# EAGLE schematic attniy85_prog_shield (EAGLE 8.5.0)
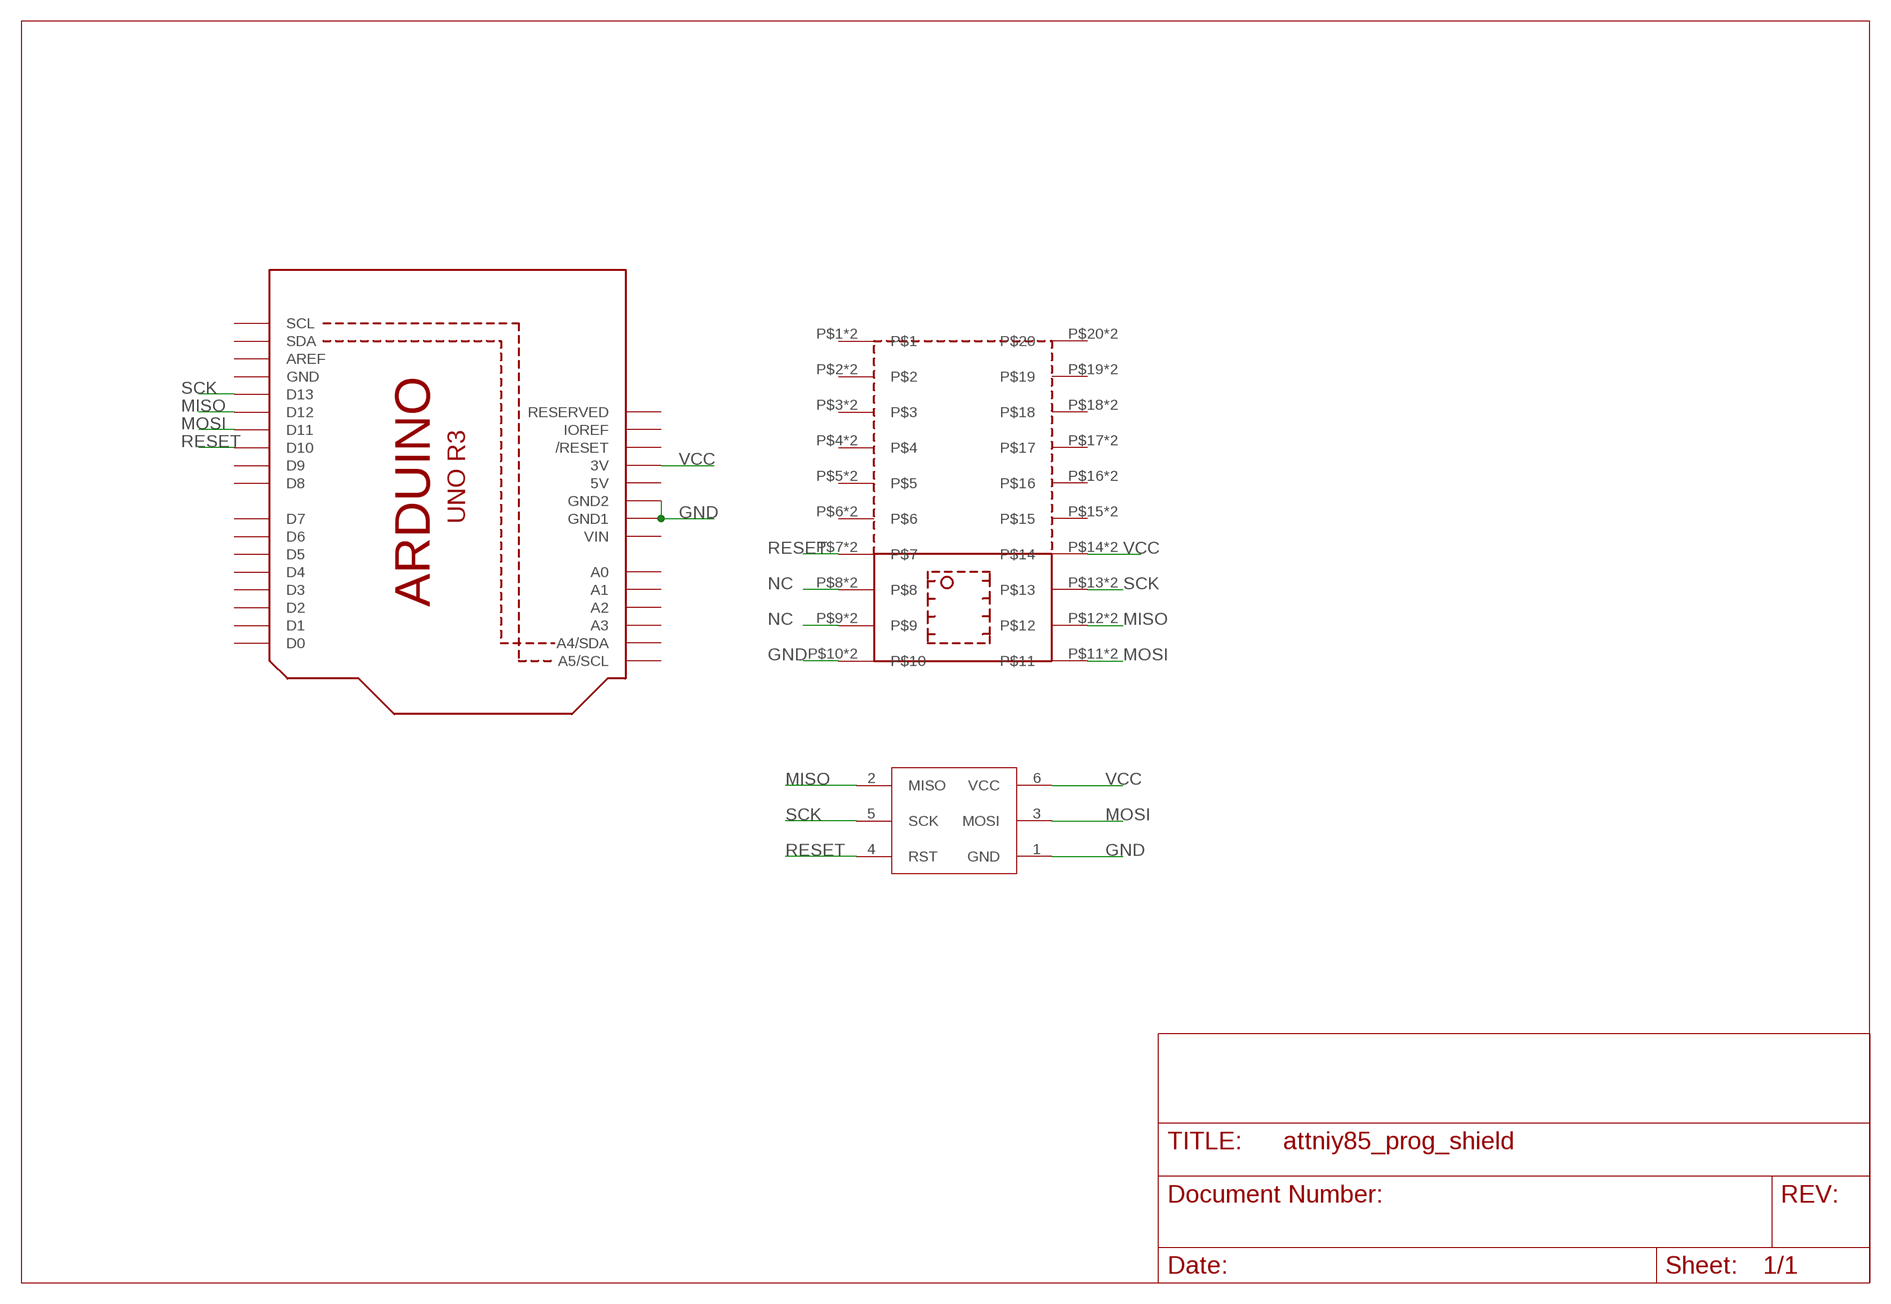
[diagram p0: schematic, sheet 1]

## Parts
U1  ARDUINOR3-BPLACE  [ARDUINOR3-BPLACE]
U$1  SOIC8_200MIL_PROG  [SOIC8-200MIL]
X1  ISP10P  [ISP10PIN]

## Nets
GND: U1.GND1 U1.GND2 U$1.P$10 U$1.P$30 X1.1(GND)
MISO: U1.D12 U$1.P$12 U$1.P$32 X1.2(MISO)
MOSI: U1.D11 U$1.P$11 U$1.P$31 X1.3(MOSI)
NC: U$1.P$8 U$1.P$9 U$1.P$28 U$1.P$29
RESET: U1.D10 U$1.P$7 U$1.P$27 X1.4(RST)
SCK: U1.D13 U$1.P$13 U$1.P$33 X1.5(SCK)
VCC: U1.3V U$1.P$14 U$1.P$34 X1.6(VCC)
Unconnected: U1.A0 U1.A1 U1.A2 U1.A3 U1.A4(A4/SDA) U1.A5(A5/SCL) U1.AREF U1.D0 U1.D1 U1.D2 U1.D3 U1.D4 U1.D5 U1.D6 U1.D7 U1.D8 U1.D9 U1.IOREF U1.RESERVED U1.RESET(/RESET) U1.SCL U1.SDA U$1.P$1 U$1.P$2 U$1.P$3 U$1.P$4 U$1.P$5 U$1.P$6 U$1.P$15 U$1.P$16 U$1.P$17 U$1.P$18 U$1.P$19 U$1.P$20 U$1.P$21 U$1.P$22 U$1.P$23 U$1.P$24 U$1.P$25 U$1.P$26 U$1.P$35 U$1.P$36 U$1.P$37 U$1.P$38 U$1.P$39 U$1.P$40

## Power pins joined to a net without a drawn wire
5V: U1.5V
GND: U1.GND
VIN: U1.VIN

## Library data of the parts
U1 = ATtami:ARDUINOR3: This is a new object for the new Arduino R3 - with extra pins that you may want to use (such as IOref, and duplicated A4/A5
U$1 = attniy85_prog_shield:SOIC8_200MIL_PROG
X1 = attniy85_prog_shield:ISP: CONNECTOR 6-pin series 057 contact pc board low profile headers

## Net classes
0 default: clearance 0.205 mm